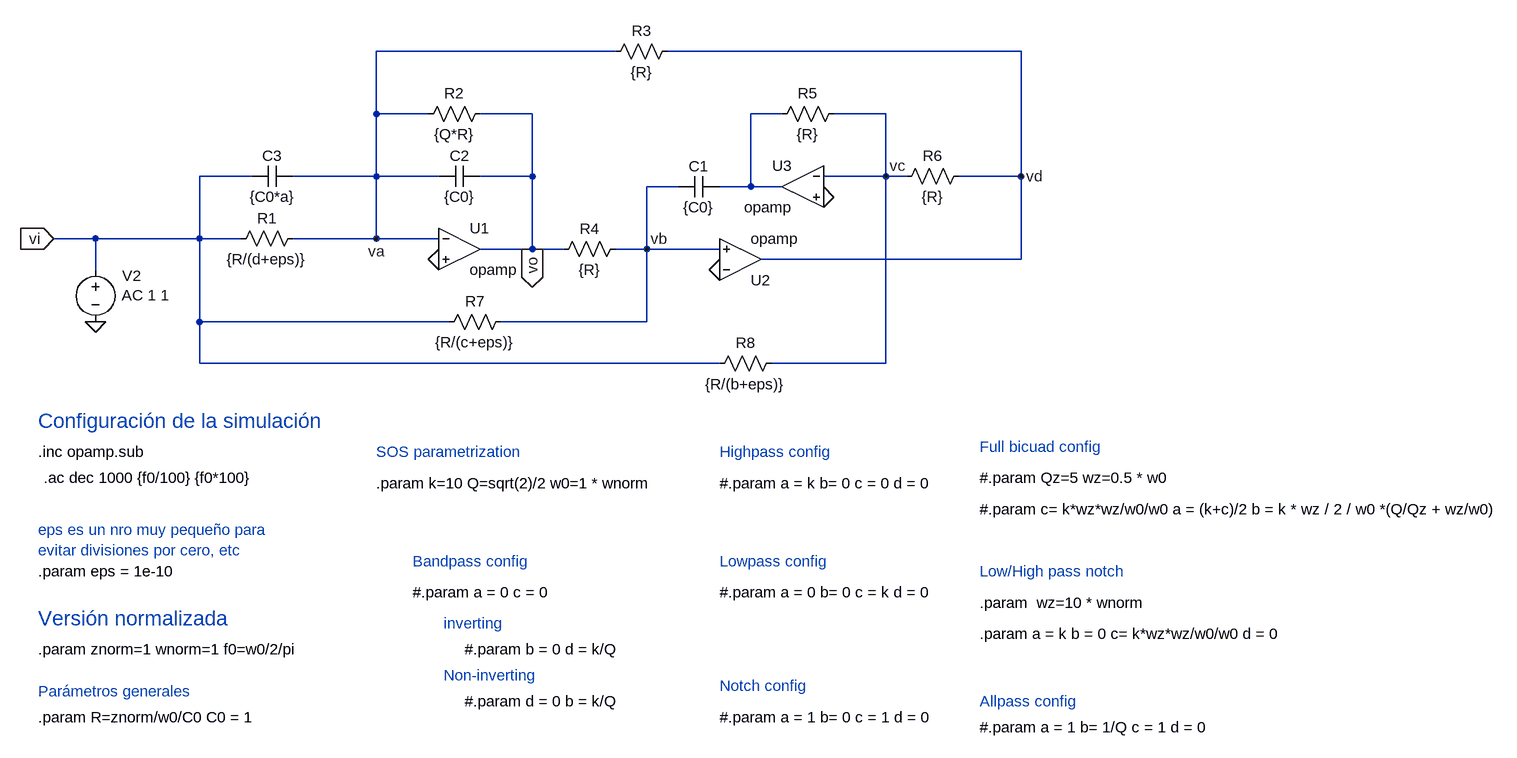
[diagram p0: schematic ACKMOSS bicuad.asc]
ACKMOSS bicuad.asc, the LTspice schematic file:
Version 4
SHEET 1 2172 1280
WIRE 384 -48 16 -48
WIRE 1008 -48 464 -48
WIRE 16 48 16 -48
WIRE 96 48 16 48
WIRE 256 48 176 48
WIRE 640 48 592 48
WIRE 800 48 720 48
WIRE -176 144 -256 144
WIRE 16 144 16 48
WIRE 16 144 -112 144
WIRE 112 144 16 144
WIRE 256 144 256 48
WIRE 256 144 176 144
WIRE 800 144 800 48
WIRE 800 144 704 144
WIRE 832 144 800 144
WIRE 1008 144 1008 -48
WIRE 1008 144 912 144
WIRE 480 160 432 160
WIRE 592 160 592 48
WIRE 592 160 544 160
WIRE 640 160 592 160
WIRE -416 240 -480 240
WIRE -256 240 -256 144
WIRE -256 240 -416 240
WIRE -192 240 -256 240
WIRE 16 240 16 144
WIRE 16 240 -112 240
WIRE 112 240 16 240
WIRE 256 256 256 144
WIRE 256 256 176 256
WIRE 304 256 256 256
WIRE 432 256 432 160
WIRE 432 256 384 256
WIRE 544 256 432 256
WIRE 1008 272 1008 144
WIRE 1008 272 608 272
WIRE -416 288 -416 240
WIRE -256 368 -256 240
WIRE 128 368 -256 368
WIRE 432 368 432 256
WIRE 432 368 208 368
WIRE -256 432 -256 368
WIRE 544 432 -256 432
WIRE 800 432 800 144
WIRE 800 432 624 432
FLAG 544 288 0
FLAG 112 272 0
FLAG 704 176 0
FLAG 256 256 vo
IOPIN 256 256 Out
FLAG -416 368 0
FLAG -480 240 vi
IOPIN -480 240 In
FLAG 16 240 va
FLAG 432 256 vb
FLAG 800 144 vc
FLAG 1008 144 vd
SYMBOL res -96 224 R90
WINDOW 0 0 56 VBottom 2
WINDOW 3 32 56 VTop 2
SYMATTR InstName R1
SYMATTR Value {R/(d+eps)}
SYMBOL res 192 32 R90
WINDOW 0 0 56 VBottom 2
WINDOW 3 32 56 VTop 2
SYMATTR InstName R2
SYMATTR Value {Q*R}
SYMBOL res 480 -64 R90
WINDOW 0 0 56 VBottom 2
WINDOW 3 32 56 VTop 2
SYMATTR InstName R3
SYMATTR Value {R}
SYMBOL res 400 240 R90
WINDOW 0 0 56 VBottom 2
WINDOW 3 32 56 VTop 2
SYMATTR InstName R4
SYMATTR Value {R}
SYMBOL res 736 32 R90
WINDOW 0 0 56 VBottom 2
WINDOW 3 32 56 VTop 2
SYMATTR InstName R5
SYMATTR Value {R}
SYMBOL res 928 128 R90
WINDOW 0 0 56 VBottom 2
WINDOW 3 32 56 VTop 2
SYMATTR InstName R6
SYMATTR Value {R}
SYMBOL cap 544 144 R90
WINDOW 0 0 32 VBottom 2
WINDOW 3 32 32 VTop 2
SYMATTR InstName C1
SYMATTR Value {C0}
SYMBOL cap 176 128 R90
WINDOW 0 0 32 VBottom 2
WINDOW 3 32 32 VTop 2
SYMATTR InstName C2
SYMATTR Value {C0}
SYMBOL OpAmps\\opamp 144 192 R0
SYMATTR InstName U1
SYMBOL OpAmps\\opamp 576 336 M180
SYMATTR InstName U2
SYMBOL OpAmps\\opamp 672 96 M0
SYMATTR InstName U3
SYMBOL voltage -416 272 R0
WINDOW 123 40 55 Left 2
WINDOW 39 0 0 Left 0
WINDOW 0 41 25 Left 2
SYMATTR Value2 AC 1 1
SYMATTR InstName V2
SYMATTR Value ""
SYMBOL cap -112 128 R90
WINDOW 0 0 32 VBottom 2
WINDOW 3 32 32 VTop 2
SYMATTR InstName C3
SYMATTR Value {C0*a}
SYMBOL res 224 352 R90
WINDOW 0 0 56 VBottom 2
WINDOW 3 32 56 VTop 2
SYMATTR InstName R7
SYMATTR Value {R/(c+eps)}
SYMBOL res 640 416 R90
WINDOW 0 0 56 VBottom 2
WINDOW 3 32 56 VTop 2
SYMATTR InstName R8
SYMATTR Value {R/(b+eps)}
TEXT -504 568 Left 2 !.inc opamp.sub
TEXT -496 608 Left 2 !.ac dec 1000 {f0/100} {f0*100}
TEXT 944 608 Left 2 !#.param Qz=5 wz=0.5 * w0
TEXT -504 824 Left 3 ;Versión normalizada
TEXT -504 872 Left 2 !.param znorm=1 wnorm=1 f0=w0/2/pi
TEXT 944 560 Left 2 ;Full bicuad config
TEXT -504 976 Left 2 !.param R=znorm/w0/C0 C0 = 1
TEXT -504 520 Left 3 ;Configuración de la simulación
TEXT 944 656 Left 2 !#.param c= k*wz*wz/w0/w0 a = (k+c)/2 b = k * wz / 2 / w0 *(Q/Qz + wz/w0)
TEXT 944 752 Left 2 ;Low/High pass notch
TEXT 944 848 Left 2 !.param a = k b = 0 c= k*wz*wz/w0/w0 d = 0
TEXT 944 800 Left 2 !.param  wz=10 * wnorm
TEXT 544 568 Left 2 ;Highpass config
TEXT 544 616 Left 2 !#.param a = k b= 0 c = 0 d = 0
TEXT 16 616 Left 2 !.param k=10 Q=sqrt(2)/2 w0=1 * wnorm
TEXT 944 952 Left 2 ;Allpass config
TEXT 944 992 Left 2 !#.param a = 1 b= 1/Q c = 1 d = 0
TEXT 544 736 Left 2 ;Lowpass config
TEXT 544 784 Left 2 !#.param a = 0 b= 0 c = k d = 0
TEXT 72 736 Left 2 ;Bandpass config
TEXT 72 784 Left 2 !#.param a = 0 c = 0
TEXT -504 936 Left 2 ;Parámetros generales
TEXT -504 752 Left 2 !.param eps = 1e-10
TEXT -504 688 Left 2 ;eps es un nro muy pequeño para\nevitar divisiones por cero, etc
TEXT 16 568 Left 2 ;SOS parametrization
TEXT 544 928 Left 2 ;Notch config
TEXT 544 976 Left 2 !#.param a = 1 b= 0 c = 1 d = 0
TEXT 120 832 Left 2 ;inverting
TEXT 120 912 Left 2 ;Non-inverting
TEXT 152 872 Left 2 !#.param b = 0 d = k/Q
TEXT 152 952 Left 2 !#.param d = 0 b = k/Q

The netlist it stands for:
* ACKMOSS bicuad.asc
R1 va vi {R/(d+eps)}
R2 vo va {Q*R}
R3 vd va {R}
R4 vb vo {R}
R5 vc N001 {R}
R6 vd vc {R}
C1 N001 vb {C0}
C2 vo va {C0}
XU1 va 0 vo opamp Aol=100K GBW=10Meg  ; pins invin noninvin out
XU2 0 vb vd opamp Aol=100K GBW=10Meg  ; pins invin noninvin out
XU3 vc 0 N001 opamp Aol=100K GBW=10Meg  ; pins invin noninvin out
V2 vi 0 AC 1 1
C3 va vi {C0*a}
R7 vb vi {R/(c+eps)}
R8 vc vi {R/(b+eps)}
.inc opamp.sub
.ac dec 1000 {f0/100} {f0*100}
#.param Qz=5 wz=0.5 * w0
* Versión normalizada
.param znorm=1 wnorm=1 f0=w0/2/pi
* Full bicuad config
.param R=znorm/w0/C0 C0 = 1
* Configuración de la simulación
#.param c= k*wz*wz/w0/w0 a = (k+c)/2 b = k * wz / 2 / w0 *(Q/Qz + wz/w0)
* Low/High pass notch
.param a = k b = 0 c= k*wz*wz/w0/w0 d = 0
.param  wz=10 * wnorm
* Highpass config
#.param a = k b= 0 c = 0 d = 0
.param k=10 Q=sqrt(2)/2 w0=1 * wnorm
* Allpass config
#.param a = 1 b= 1/Q c = 1 d = 0
* Lowpass config
#.param a = 0 b= 0 c = k d = 0
* Bandpass config
#.param a = 0 c = 0
* Parámetros generales
.param eps = 1e-10
* eps es un nro muy pequeño para
* evitar divisiones por cero, etc
* SOS parametrization
* Notch config
#.param a = 1 b= 0 c = 1 d = 0
* inverting
* Non-inverting
#.param b = 0 d = k/Q
#.param d = 0 b = k/Q
.backanno
.end